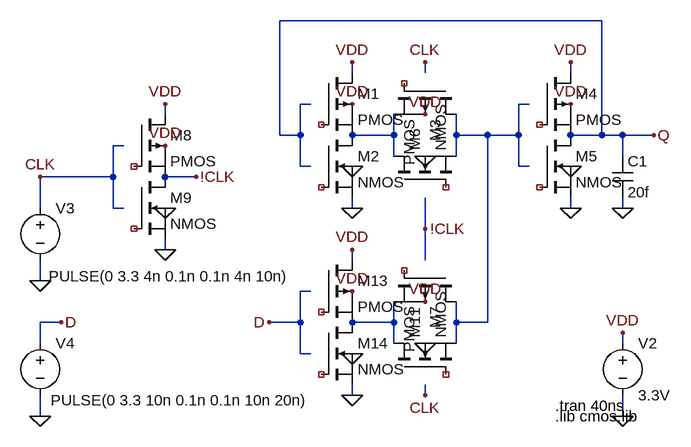
[diagram p0: schematic positive-latch.asc]
positive-latch.asc, the LTspice schematic file:
Version 4
SHEET 1 1292 680
WIRE -992 -688 -1488 -688
WIRE -1376 -608 -1376 -624
WIRE -1264 -608 -1264 -624
WIRE -1040 -608 -1040 -624
WIRE -1440 -560 -1456 -560
WIRE -1104 -560 -1120 -560
WIRE -1664 -544 -1664 -560
WIRE -1488 -512 -1488 -688
WIRE -1456 -512 -1456 -560
WIRE -1456 -512 -1488 -512
WIRE -1312 -512 -1312 -544
WIRE -1312 -512 -1376 -512
WIRE -1216 -512 -1216 -544
WIRE -1168 -512 -1216 -512
WIRE -1120 -512 -1120 -560
WIRE -1120 -512 -1168 -512
WIRE -992 -512 -992 -688
WIRE -992 -512 -1040 -512
WIRE -960 -512 -992 -512
WIRE -912 -512 -960 -512
WIRE -1728 -496 -1744 -496
WIRE -1312 -480 -1312 -512
WIRE -1216 -480 -1216 -512
WIRE -960 -480 -960 -512
WIRE -1456 -464 -1456 -512
WIRE -1440 -464 -1456 -464
WIRE -1120 -464 -1120 -512
WIRE -1104 -464 -1120 -464
WIRE -1744 -448 -1744 -496
WIRE -1744 -448 -1856 -448
WIRE -1616 -448 -1664 -448
WIRE -1856 -400 -1856 -448
WIRE -1744 -400 -1744 -448
WIRE -1728 -400 -1744 -400
WIRE -1376 -400 -1376 -416
WIRE -1040 -400 -1040 -416
WIRE -960 -400 -960 -416
WIRE -1264 -368 -1264 -416
WIRE -1664 -336 -1664 -352
WIRE -1376 -320 -1376 -336
WIRE -1264 -320 -1264 -368
WIRE -1856 -288 -1856 -320
WIRE -1440 -272 -1456 -272
WIRE -1824 -224 -1856 -224
WIRE -1456 -224 -1456 -272
WIRE -1456 -224 -1504 -224
WIRE -1312 -224 -1312 -256
WIRE -1312 -224 -1376 -224
WIRE -1216 -224 -1216 -256
WIRE -1168 -224 -1168 -512
WIRE -1168 -224 -1216 -224
WIRE -1856 -192 -1856 -224
WIRE -1312 -192 -1312 -224
WIRE -1216 -192 -1216 -224
WIRE -960 -192 -960 -208
WIRE -1456 -176 -1456 -224
WIRE -1440 -176 -1456 -176
WIRE -1376 -112 -1376 -128
WIRE -1264 -112 -1264 -128
WIRE -1856 -80 -1856 -112
WIRE -960 -80 -960 -112
FLAG -960 -80 0
FLAG -960 -208 VDD
FLAG -912 -512 Q
FLAG -1856 -288 0
FLAG -1856 -448 CLK
FLAG -1856 -80 0
FLAG -1824 -224 D
FLAG -960 -400 0
FLAG -1040 -464 0
FLAG -1040 -560 VDD
FLAG -1040 -624 VDD
FLAG -1040 -400 0
FLAG -1664 -400 0
FLAG -1664 -496 VDD
FLAG -1664 -560 VDD
FLAG -1664 -336 0
FLAG -1616 -448 !CLK
FLAG -1376 -464 0
FLAG -1376 -560 VDD
FLAG -1376 -624 VDD
FLAG -1376 -400 0
FLAG -1264 -480 0
FLAG -1264 -544 VDD
FLAG -1264 -192 0
FLAG -1264 -256 VDD
FLAG -1376 -176 0
FLAG -1376 -272 VDD
FLAG -1376 -336 VDD
FLAG -1376 -112 0
FLAG -1504 -224 D
FLAG -1264 -112 CLK
FLAG -1264 -624 CLK
FLAG -1264 -368 !CLK
SYMBOL voltage -960 -208 R0
WINDOW 123 0 0 Left 2
WINDOW 39 0 0 Left 2
SYMATTR InstName V2
SYMATTR Value 3.3V
SYMBOL voltage -1856 -416 R0
WINDOW 123 0 0 Left 2
WINDOW 39 0 0 Left 2
WINDOW 3 13 121 Left 2
SYMATTR Value PULSE(0 3.3 4n 0.1n 0.1n 4n 10n)
SYMATTR InstName V3
SYMBOL voltage -1856 -208 R0
WINDOW 123 0 0 Left 2
WINDOW 39 0 0 Left 2
WINDOW 3 16 104 Left 2
SYMATTR Value PULSE(0 3.3 10n 0.1n 0.1n 10n 20n)
SYMATTR InstName V4
SYMBOL cap -976 -480 R0
SYMATTR InstName C1
SYMATTR Value 20f
SYMBOL pmos -1088 -608 R0
SYMATTR InstName M4
SYMATTR Value2 l=0.6u w=1.8u
SYMATTR SpiceModel ""
SYMATTR Value PMOS
SYMBOL nmos -1088 -512 R0
SYMATTR InstName M5
SYMATTR SpiceModel ""
SYMATTR Value NMOS
SYMATTR Value2 l=0.6u w=0.9u
SYMBOL pmos -1712 -544 R0
SYMATTR InstName M8
SYMATTR Value2 l=0.6u w=6u
SYMATTR SpiceModel ""
SYMATTR Value PMOS
SYMBOL nmos -1712 -448 R0
SYMATTR InstName M9
SYMATTR SpiceModel ""
SYMATTR Value NMOS
SYMATTR Value2 l=0.6u w=3u
SYMBOL pmos -1424 -608 R0
SYMATTR InstName M1
SYMATTR Value2 l=0.6u w=1.8u
SYMATTR SpiceModel ""
SYMATTR Value PMOS
SYMBOL nmos -1424 -512 R0
SYMATTR InstName M2
SYMATTR SpiceModel ""
SYMATTR Value NMOS
SYMATTR Value2 l=0.6u w=0.9u
SYMBOL pmos -1216 -592 R90
SYMATTR InstName M3
SYMATTR Value2 l=0.6u w=1.8u
SYMATTR SpiceModel ""
SYMATTR Value PMOS
SYMBOL nmos -1312 -432 R270
SYMATTR InstName M6
SYMATTR SpiceModel ""
SYMATTR Value NMOS
SYMATTR Value2 l=0.6u w=0.9u
SYMBOL pmos -1216 -304 R90
SYMATTR InstName M7
SYMATTR Value2 l=0.6u w=1.8u
SYMATTR SpiceModel ""
SYMATTR Value PMOS
SYMBOL nmos -1312 -144 R270
SYMATTR InstName M11
SYMATTR SpiceModel ""
SYMATTR Value NMOS
SYMATTR Value2 l=0.6u w=0.9u
SYMBOL pmos -1424 -320 R0
SYMATTR InstName M13
SYMATTR Value2 l=0.6u w=1.8u
SYMATTR SpiceModel ""
SYMATTR Value PMOS
SYMBOL nmos -1424 -224 R0
SYMATTR InstName M14
SYMATTR SpiceModel ""
SYMATTR Value NMOS
SYMATTR Value2 l=0.6u w=0.9u
TEXT -1064 -80 Left 2 !.lib cmos.lib
TEXT -1064 -96 Left 2 !.tran 40ns

The netlist it stands for:
* positive-latch.asc
V2 VDD 0 3.3V
V3 CLK 0 PULSE(0 3.3 4n 0.1n 0.1n 4n 10n)
V4 D 0 PULSE(0 3.3 10n 0.1n 0.1n 10n 20n)
C1 Q 0 20f
* M4: PMOS l=0.6u w=1.8u (symbol pmos not certain, pin order unknown); nets seen at it: Q, VDD
* M5: NMOS l=0.6u w=0.9u (symbol nmos not certain, pin order unknown); nets seen at it: 0, Q
* M8: PMOS l=0.6u w=6u (symbol pmos not certain, pin order unknown); nets seen at it: !CLK, VDD
* M9: NMOS l=0.6u w=3u (symbol nmos not certain, pin order unknown); nets seen at it: !CLK, 0
* M1: PMOS l=0.6u w=1.8u (symbol pmos not certain, pin order unknown); nets seen at it: N002, VDD
* M2: NMOS l=0.6u w=0.9u (symbol nmos not certain, pin order unknown); nets seen at it: 0, N002
* M3: PMOS l=0.6u w=1.8u (symbol pmos not certain, pin order unknown); nets seen at it: N001, N002
* M6: NMOS l=0.6u w=0.9u (symbol nmos not certain, pin order unknown); nets seen at it: N001, N002
* M7: PMOS l=0.6u w=1.8u (symbol pmos not certain, pin order unknown); nets seen at it: N001, N003
* M11: NMOS l=0.6u w=0.9u (symbol nmos not certain, pin order unknown); nets seen at it: N001, N003
* M13: PMOS l=0.6u w=1.8u (symbol pmos not certain, pin order unknown); nets seen at it: N003, VDD
* M14: NMOS l=0.6u w=0.9u (symbol nmos not certain, pin order unknown); nets seen at it: 0, N003
.lib cmos.lib
.tran 40ns
.backanno
.end